# Altium project pcDuino Link Board.PrjPcb
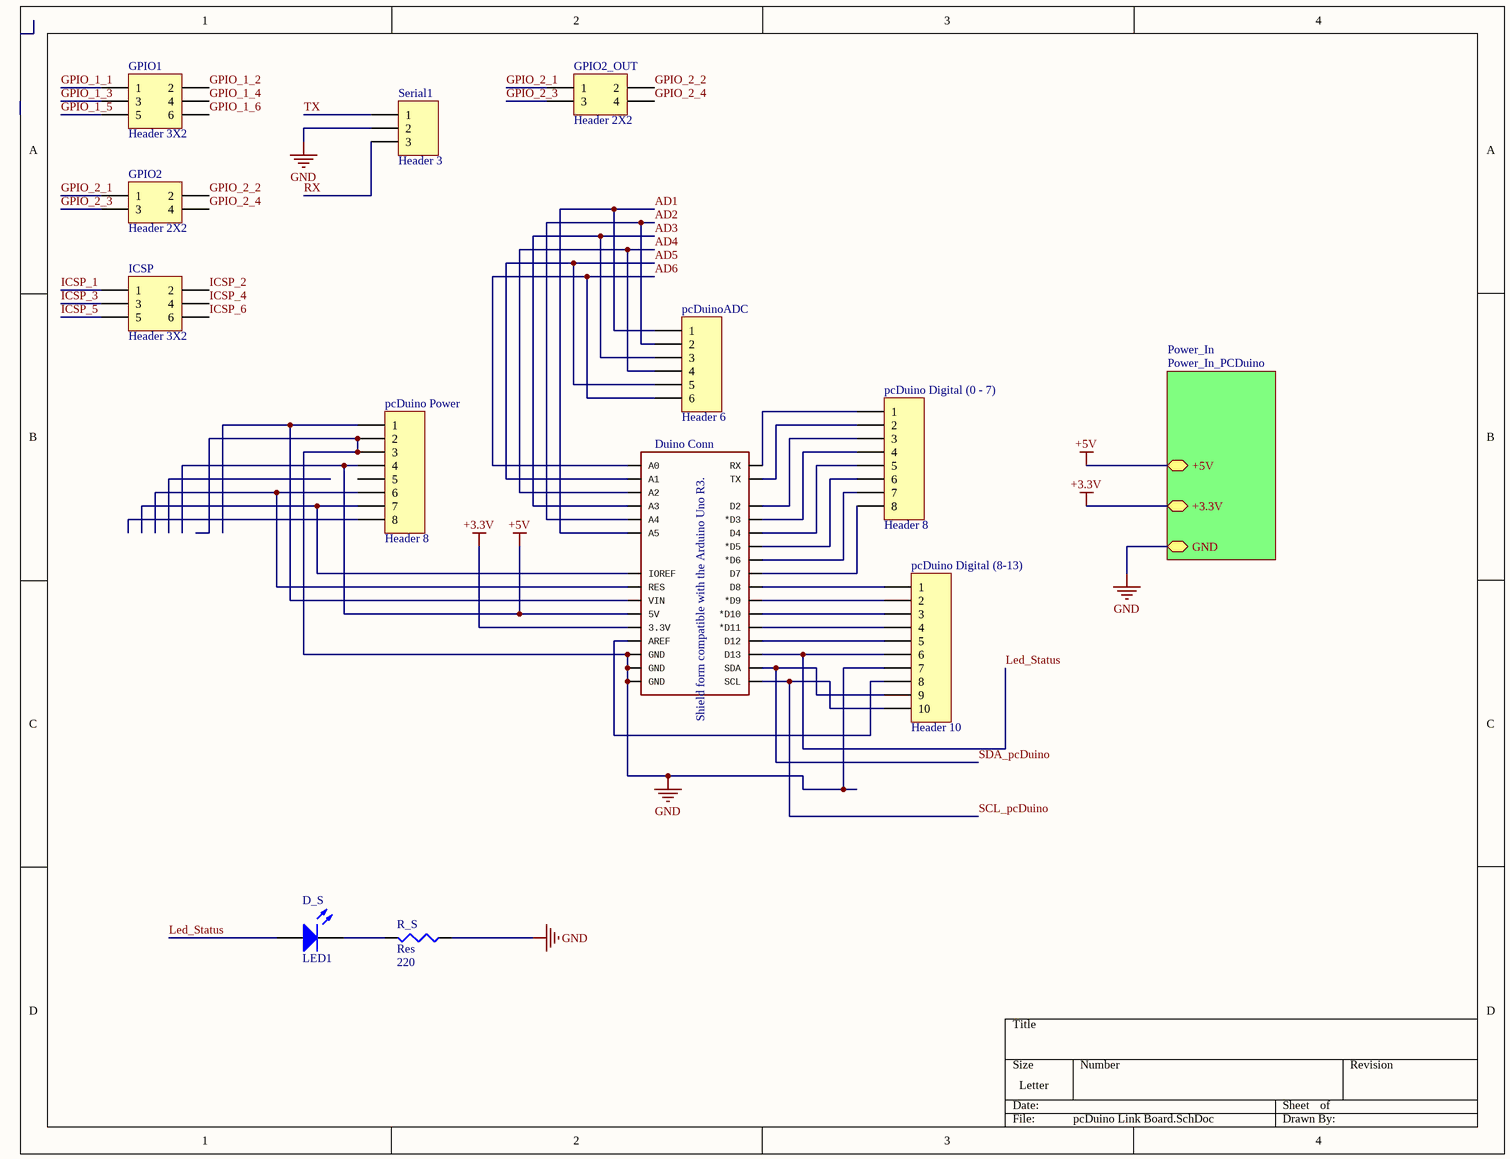
[diagram p0: pcDuino Link Board.SchDoc]
2 sheets, 25 parts. Net scope: hierarchical (ports join the sheet entries above them; power ports are global).
Board file: pcDuino Link Board.PcbDoc
Sheets:
  pcDuino Link Board.SchDoc
    Power_In = Power_In_PCDuino.SchDoc

## Sheet pcDuino Link Board.SchDoc
size Letter

### Parts
D_S  LED1  [LED-1]
Duino_Conn  Shield form compatible with the Arduino Uno R3.  [UNO_R3_SHIELD]
GPIO1  Header 3X2  [HDR2X3]
GPIO2  Header 2X2  [HDR2X2]
GPIO2_OUT  Header 2X2  [HDR2X2]
ICSP  Header 3X2  [HDR2X3]
pcDuino_Digital_(0_-_7)  Header 8  [HDR1X8]
pcDuino_Digital_(8-13)  Header 10  [HDR1X10]
pcDuino_Power  Header 8  [HDR1X8]
pcDuinoADC  Header 6  [HDR1X6]
R_S  Res  value 220  [RESC6332]
Serial1  Header 3  [HDR1X3]

### Sub-sheets
Power_In = Power_In_PCDuino: GND, +3.3V, +5V

### Nets
+3.3V: Duino_Conn.3.3V ; sheet Power_In/+3.3V
+5V: Duino_Conn.5V pcDuino_Power.4 ; sheet Power_In/+5V
GND: Duino_Conn.GND@0(GND) Duino_Conn.GND@1(GND) Duino_Conn.GND@2(GND) pcDuino_Digital_(8-13).7 pcDuino_Power.2 pcDuino_Power.3 R_S.1 Serial1.2 ; sheet Power_In/GND
AD1: Duino_Conn.A5 pcDuinoADC.1
AD2: Duino_Conn.A4 pcDuinoADC.2
AD3: Duino_Conn.A3 pcDuinoADC.3
AD4: Duino_Conn.A2 pcDuinoADC.4
AD5: Duino_Conn.A1 pcDuinoADC.5
AD6: Duino_Conn.A0 pcDuinoADC.6
GPIO_1_1: GPIO1.1
GPIO_1_2: GPIO1.2
GPIO_1_3: GPIO1.3
GPIO_1_4: GPIO1.4
GPIO_1_5: GPIO1.5
GPIO_1_6: GPIO1.6
GPIO_2_1: GPIO2.1 GPIO2_OUT.1
GPIO_2_2: GPIO2.2 GPIO2_OUT.2
GPIO_2_3: GPIO2.3 GPIO2_OUT.3
GPIO_2_4: GPIO2.4 GPIO2_OUT.4
ICSP_1: ICSP.1
ICSP_2: ICSP.2
ICSP_3: ICSP.3
ICSP_4: ICSP.4
ICSP_5: ICSP.5
ICSP_6: ICSP.6
Led_Status: D_S.1(A) Duino_Conn.D13 pcDuino_Digital_(8-13).6
RX: Serial1.3
SCL_pcDuino: Duino_Conn.SCL pcDuino_Digital_(8-13).10
SDA_pcDuino: Duino_Conn.SDA pcDuino_Digital_(8-13).9
TX: Serial1.1
NetD_S_2: D_S.2(K) R_S.2
NetDuino_Conn_AREF: Duino_Conn.AREF pcDuino_Digital_(8-13).8
NetDuino_Conn_D2: Duino_Conn.D2 pcDuino_Digital_(0_-_7).3
NetDuino_Conn_D3: Duino_Conn.D3(*D3) pcDuino_Digital_(0_-_7).4
NetDuino_Conn_D4: Duino_Conn.D4 pcDuino_Digital_(0_-_7).5
NetDuino_Conn_D5: Duino_Conn.D5(*D5) pcDuino_Digital_(0_-_7).6
NetDuino_Conn_D6: Duino_Conn.D6(*D6) pcDuino_Digital_(0_-_7).7
NetDuino_Conn_D7: Duino_Conn.D7 pcDuino_Digital_(0_-_7).8
NetDuino_Conn_D8: Duino_Conn.D8 pcDuino_Digital_(8-13).1
NetDuino_Conn_D9: Duino_Conn.D9(*D9) pcDuino_Digital_(8-13).2
NetDuino_Conn_D10: Duino_Conn.D10(*D10) pcDuino_Digital_(8-13).3
NetDuino_Conn_D11: Duino_Conn.D11(*D11) pcDuino_Digital_(8-13).4
NetDuino_Conn_D12: Duino_Conn.D12 pcDuino_Digital_(8-13).5
NetDuino_Conn_IOREF: Duino_Conn.IOREF pcDuino_Power.7
NetDuino_Conn_RES: Duino_Conn.RES pcDuino_Power.6
NetDuino_Conn_RX: Duino_Conn.RX pcDuino_Digital_(0_-_7).1
NetDuino_Conn_TX: Duino_Conn.TX pcDuino_Digital_(0_-_7).2
NetDuino_Conn_VIN: Duino_Conn.VIN pcDuino_Power.1

Not connected (* = marked no-connect by the designer): pcDuino_Power 5 8

### Library data of the parts
D_S = LED1: Typical RED GaAs LED; Published: 8-Jun-2000; LatestRevisionDate: 08-Jul-2005; LatestRevisionNote: Mech Layer 1 removed.; PackageReference: LED-1; Publisher: Altium Limited; PackageDescription: LED; 2 Leads
Duino_Conn = ARDUINO_R3_SHIELDNOLABELS
GPIO1 ICSP = Header 3X2: Header, 3-Pin, Dual row; LatestRevisionDate: 17-Jul-2002; LatestRevisionNote: Re-released for DXP Platform.; Publisher: Altium Limited
GPIO2 GPIO2_OUT = Header 2X2: Header, 2-Pin, Dual row; LatestRevisionDate: 17-Jul-2002; LatestRevisionNote: Re-released for DXP Platform.; Publisher: Altium Limited
pcDuino_Digital_(0_-_7) pcDuino_Power = Header 8: Header, 8-Pin; LatestRevisionDate: 17-Jul-2002; LatestRevisionNote: Re-released for DXP Platform.; Publisher: Altium Limited
pcDuino_Digital_(8-13) = Header 10: Header, 10-Pin; LatestRevisionDate: 17-Jul-2002; LatestRevisionNote: Re-released for DXP Platform.; Publisher: Altium Limited
pcDuinoADC = Header 6: Header, 6-Pin; LatestRevisionDate: 17-Jul-2002; LatestRevisionNote: Re-released for DXP Platform.; Publisher: Altium Limited
R_S = Res3: Resistor; Published: 8-Jun-2000; LatestRevisionDate: 29-May-2009; LatestRevisionNote: IPC-7351 Footprint Added.; PackageReference: J1-0603; Publisher: Altium Limited; PackageDescription: Chip Resistor
Serial1 = Header 3: Header, 3-Pin; LatestRevisionDate: 17-Jul-2002; LatestRevisionNote: Re-released for DXP Platform.; Publisher: Altium Limited

## Sheet Power_In_PCDuino.SchDoc
size Letter
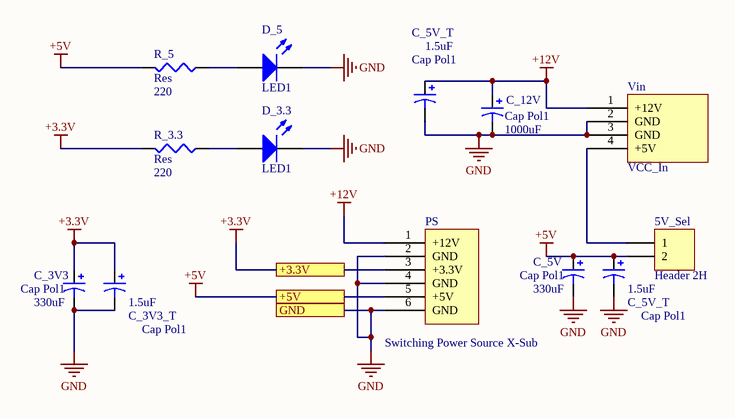
[diagram p1: Power_In_PCDuino.SchDoc]

### Parts
(Parts that share a designator on the sheet are numbered #1, #2 ... from top to bottom, then left to right.)
5V_Sel  Header 2H  [HDR1X2H]
C_3V3  Cap Pol1  value 330uF  [C Panasonic Size Cap Pol]
C_3V3_T  Cap Pol1  value 1.5uF  [6-0805_L]
C_5V  Cap Pol1  value 330uF  [C Panasonic Size Cap Pol]
C_5V_T#1  Cap Pol1  value 1.5uF  [6-0805_L]
C_5V_T#2  Cap Pol1  value 1.5uF  [6-0805_L]
C_12V  Cap Pol1  value 1000uF  [C Panasonic Size Cap Pol]
D_3.3  LED1  [LED-1]
D_5  LED1  [LED-1]
PS  Switching Power Source X-Sub  [Fuente_Switching]
R_3.3  Res  value 220  [J1-0603]
R_5  Res  value 220  [J1-0603]
Vin  VCC_In  [Vcc_In]

### Ports
+3.3V, +5V, GND

### Nets
+3.3V: C_3V3.1 C_3V3_T.1 PS.3(+3.3V) R_3.3.2 ; port +3.3V
+5V: 5V_Sel.2 C_5V.1 C_5V_T#2.1 PS.5(+5V) R_5.2 ; port +5V
+12V: C_5V_T#1.1 C_12V.1 PS.1(+12V) Vin.1(+12V)
GND: C_3V3.2 C_3V3_T.2 C_5V.2 C_5V_T#1.2 C_5V_T#2.2 C_12V.2 D_3.3.2(K) D_5.2(K) PS.2(GND) PS.4(GND) PS.6(GND) Vin.2(GND) Vin.3(GND) ; port GND
Net5V_Sel_1: 5V_Sel.1 Vin.4(+5V)
NetD_3.3_1: D_3.3.1(A) R_3.3.1
NetD_5_1: D_5.1(A) R_5.1

### Library data of the parts
5V_Sel = Header 2H: Header, 2-Pin, Right Angle; LatestRevisionDate: 17-Jul-2002; LatestRevisionNote: Re-released for DXP Platform.; Publisher: Altium Limited
C_3V3 C_5V C_12V = Cap Pol1: Polarized Capacitor (Radial); Published: 8-Jun-2000; LatestRevisionDate: 17-Jul-2002; LatestRevisionNote: Re-released for DXP Platform.; PackageReference: RB7.6-15; Publisher: Altium Limited; PackageDescription: Polarized Capacitor (Radial); 2 Leads
C_3V3_T C_5V_T#1 C_5V_T#2 = Cap Pol1: Tantalum; Published: 8-Jun-2000; LatestRevisionDate: 17-Jul-2002; LatestRevisionNote: Re-released for DXP Platform.; PackageReference: RB7.6-15; Publisher: Altium Limited; PackageDescription: Polarized Capacitor (Radial); 2 Leads
D_3.3 D_5 = LED1: Typical RED GaAs LED; Published: 8-Jun-2000; LatestRevisionDate: 08-Jul-2005; LatestRevisionNote: Mech Layer 1 removed.; PackageReference: LED-1; Publisher: Altium Limited; PackageDescription: LED; 2 Leads
R_3.3 R_5 = Res3: Resistor; Published: 8-Jun-2000; LatestRevisionDate: 29-May-2009; LatestRevisionNote: IPC-7351 Footprint Added.; PackageReference: J1-0603; Publisher: Altium Limited; PackageDescription: Chip Resistor
Vin = VCC_In: pin to pad: 1>0 2>1 3>2 4>3

## Nets that join several sheets
+3.3V: pcDuino Link Board (Duino_Conn.3.3V), Power_In_PCDuino (C_3V3.1 C_3V3_T.1 PS.3 R_3.3.2)
+5V: pcDuino Link Board (Duino_Conn.5V pcDuino_Power.4), Power_In_PCDuino (5 pins)
GND: pcDuino Link Board (8 pins), Power_In_PCDuino (13 pins)